# Altium schematic sheet 301_Sensor.SchDoc
size A4
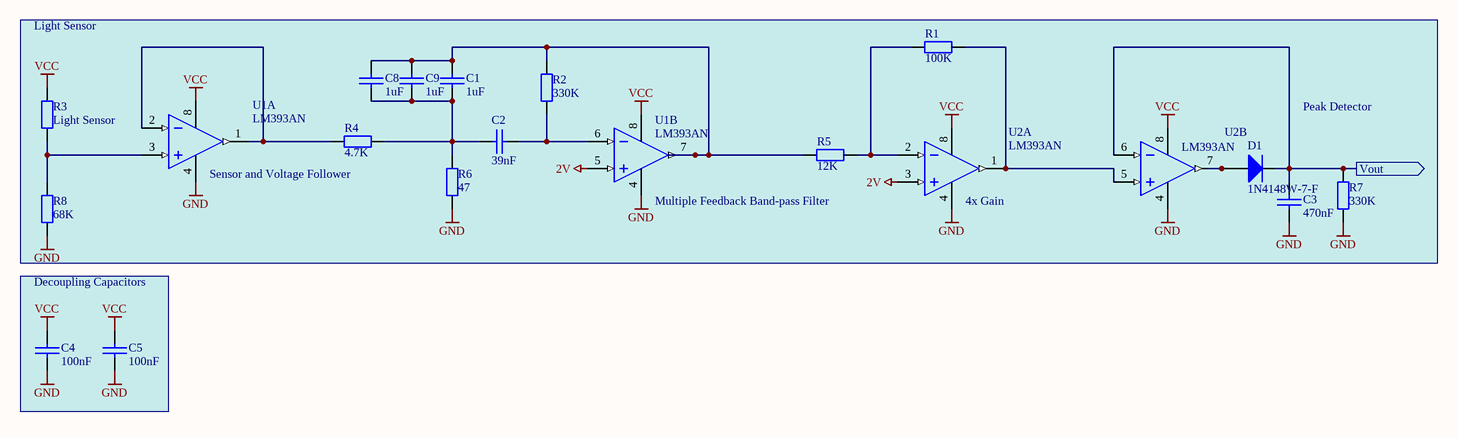
[diagram p0: 301_Sensor.SchDoc]

## Parts
C1  1uF  [ece-CC2012-0805]
C2  39nF  [ece-CC2012-0805]
C3  470nF  [ece-CC2012-0805]
C4  100nF  [ece-RAD0.2]
C5  100nF  [ece-RAD0.2]
C8  1uF  [ece-CC2012-0805]
C9  1uF  [ece-CC2012-0805]
D1  1N4148W-7-F  [SOD123]
R1  100K  [RESC2012-0805SM]
R2  330K  [RESC2012-0805SM]
R3  Light Sensor  [RESC2012-0805SM]
R4  4.7K  [RESC2012-0805SM]
R5  12K  [RESC2012-0805SM]
R6  47  [RESC2012-0805SM]
R7  330K  [RESC2012-0805SM]
R8  68K  [RESC2012-0805SM]
U1  LM393AN  [ECE-DIP8]  (parts A,B of 2)
U2  LM393AN  [ECE-DIP8]  (parts A,B of 2)

## Blocks framed on the sheet
Decoupling Capacitors: C4 C5

## Ports
Vout (out)

## Nets
2V: U1.5(IN+) U2.3(IN+)
GND: C3.2 C4.2 C5.2 R6.1 R7.1 R8.1 U1.4(GND) U2.4(GND)
VCC: C4.1 C5.1 R3.2 U1.8(V+) U2.8(V+)
Vout: C3.1 D1.2(K) R7.2 U2.6(IN-) ; port Vout
NetC1_1: C1.1 C8.1 C9.1 R2.2 R5.2 U1.7(OUT)
NetC1_2: C1.2 C2.1 C8.2 C9.2 R4.2 R6.2
NetC2_2: C2.2 R2.1 U1.6(IN-)
NetD1_1: D1.1(A) U2.7(OUT)
NetR1_1: R1.1 R5.1 U2.2(IN-)
NetR1_2: R1.2 U2.1(OUT) U2.5(IN+)
NetR3_1: R3.1 R8.2 U1.3(IN+)
NetR4_1: R4.1 U1.1(OUT) U1.2(IN-)

## Notes on the sheet
- Light Sensor
- Peak Detector
- (near U1) Sensor and Voltage Follower
- Multiple Feedback Band-pass Filter
- (near U2) 4x Gain

## Library data of the parts
C1-C3 C8 C9 = CAP SM0805: SM capacitor
  C1 C8 C9: Value: 1uF
  C2: Value: 39nF
  C3: Value: 470nF
C4 C5 = CAP: Capacitor Non Polarised Through Hole; Value: 100nF
D1 = SMT-Diode 1N4148W-7-F: DIODE GEN PURP 100V 300MA SOD123; Manufacturer: Diodes Incorporated; Manufacturer Part Number: 1N4148W-13-F; Diode Type: Standard; Current - Average Rectified (Io): 150mA; Speed: Small Signal =< 200mA (Io), Any Speed; Capacitance @ Vr, F: 2pF @ 0V, 1MHz; Supplier 1: Digi-Key; RoHS: RoHS Compliant; Category: Discrete Semiconductor Products; Stock 1: 5282; Pricing 1: 1=0.33, 10=0.292, 100=0.1586, 500=0.0976, 1000=0.06656 (NZD); Packaging: Cut Tape (CT); Part Status: Active; Mounting Type: Surface Mount; Package / Case: SOD-123; Supplier Device Package: SOD-123; Operating Temperature - Junction: -65°C ~ 150°C; Base Part Number: 1N4148W; ComponentLink1URL: https://www.diodes.com/assets/Datasheets/ds30086.pdf; ComponentLink1Description: https://www.diodes.com/assets/Datasheets/ds30086.pdf; Supplier Part Number 1: 1N4148W-13FDICT-ND
R1-R8 = Res SM 0805: SM resistor
  R1: Value: 100K
  R2 R7: Value: 330K
  R3: Value: Light Sensor
  R4: Value: 4.7K
  R5: Value: 12K
  R6: Value: 47
  R8: Value: 68K
U1 U2 = LM393AN: Dual Comparator; Published: 17-Jul-2002; LatestRevisionDate: 06-Jun-2005; LatestRevisionNote: Stylized 3D Model Added.; DatasheetVersion: 1988; PackageReference: 626-05; Publisher: Altium Limited; PackageDescription: DIP; 8 Leads; Row Spacing 7.62 mm; Pitch 2.54 mm; ComponentLink1Description: Manufacturer Link; ComponentLink1URL: http://www.onsemi.com/site/products/taxonomy/0,4438,133,00.html